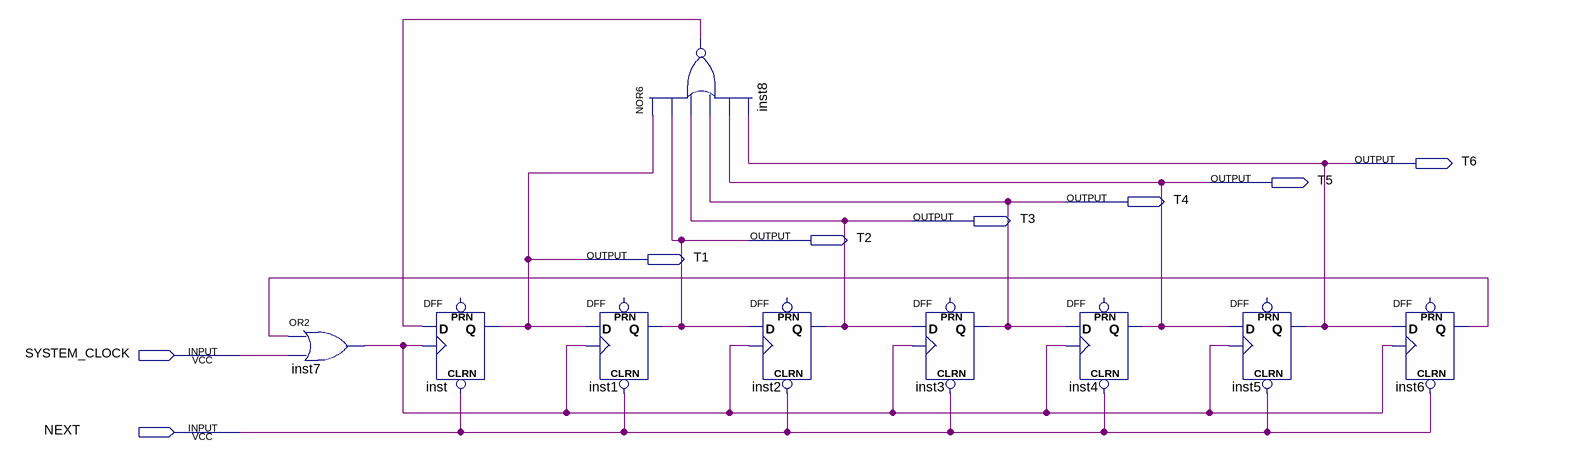
[diagram p0: schematic sheet]
// Quartus schematic DBGBeater.bdf as structural Verilog: 9 symbols, 8 pins
module DBGBeater (
  input  SYSTEM_CLOCK,
  input  NEXT,
  output T6,
  output T5,
  output T4,
  output T3,
  output T2,
  output T1
);

  wire inst6_q, inst7_out, inst8_out;

  or inst7 (inst7_out, inst6_q, SYSTEM_CLOCK);
  DFF inst (.CLRN(NEXT), .CLK(inst7_out), .D(inst8_out), .Q(T1));  // open: PRN
  nor inst8 (inst8_out, T1, T2, T3, T4, T5, T6);
  DFF inst1 (.CLRN(NEXT), .CLK(inst7_out), .D(T1), .Q(T2));  // open: PRN
  DFF inst2 (.CLRN(NEXT), .CLK(inst7_out), .D(T2), .Q(T3));  // open: PRN
  DFF inst3 (.CLRN(NEXT), .CLK(inst7_out), .D(T3), .Q(T4));  // open: PRN
  DFF inst4 (.CLRN(NEXT), .CLK(inst7_out), .D(T4), .Q(T5));  // open: PRN
  DFF inst5 (.CLRN(NEXT), .CLK(inst7_out), .D(T5), .Q(T6));  // open: PRN
  DFF inst6 (.CLRN(NEXT), .CLK(inst7_out), .D(T6), .Q(inst6_q));  // open: PRN
endmodule
